# Altium schematic sheet Drivers.SchDoc
size A4
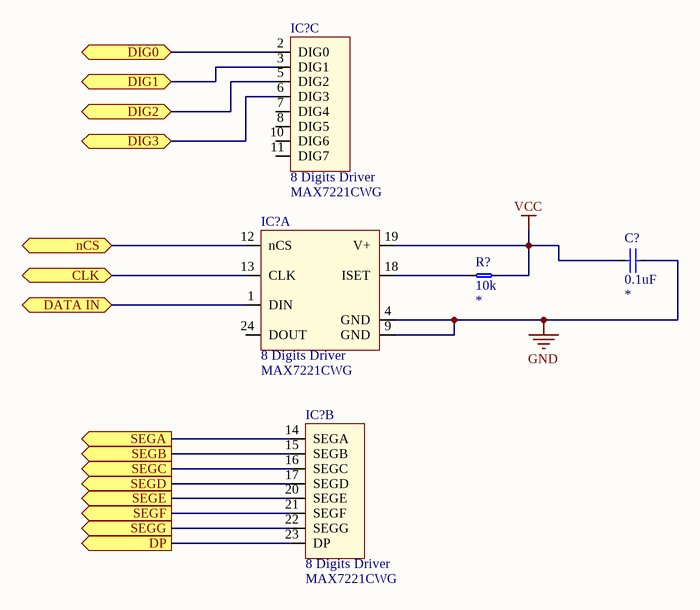
[diagram p0: Drivers.SchDoc]

## Parts
(Parts that share a designator on the sheet are numbered #1, #2 ... from top to bottom, then left to right.)
C?  value 0.1uF  [0402_CAP_LD]  (hidden comment: CerCap)
IC?#1  8 Digits Driver  [MAX7221CWG]  (part C of 3)
IC?#2  8 Digits Driver  [MAX7221CWG]  (part A of 3)
IC?#3  8 Digits Driver  [MAX7221CWG]  (part B of 3)
R?  value 10k  [0603_RES_LD]  (hidden comment: Resistor)

## Ports
CLK, DATA IN, DIG0, DIG1, DIG2, DIG3, DP (out), nCS, SEGA (out), SEGB (out), SEGC (out), SEGD (out), SEGE (out), SEGF (out), SEGG (out)

## Nets
GND: C?.2 IC?#2.4(GND) IC?#2.9(GND)
VCC: C?.1 IC?#2.19(V+) R?.2
CLK: IC?#2.13(CLK) ; port CLK
DATA IN: IC?#2.1(DIN) ; port DATA IN
DIG0: IC?#1.2(DIG0) ; port DIG0
DIG1: IC?#1.3(DIG1) ; port DIG1
DIG2: IC?#1.5(DIG2) ; port DIG2
DIG3: IC?#1.6(DIG3) ; port DIG3
DP: IC?#3.23(DP) ; port DP
nCS: IC?#2.12(nCS) ; port nCS
SEGA: IC?#3.14(SEGA) ; port SEGA
SEGB: IC?#3.15(SEGB) ; port SEGB
SEGC: IC?#3.16(SEGC) ; port SEGC
SEGD: IC?#3.17(SEGD) ; port SEGD
SEGE: IC?#3.20(SEGE) ; port SEGE
SEGF: IC?#3.21(SEGF) ; port SEGF
SEGG: IC?#3.22(SEGG) ; port SEGG
NetIC?#2_18: IC?#2.18(ISET) R?.1

Not connected (* = marked no-connect by the designer): IC?#1 7(DIG4) 8(DIG5) 10(DIG6) 11(DIG7); IC?#2 24(DOUT)

## Library data of the parts
C? = CerCap: Ceramic Capacitor; Type: *; Voltage/Power: *; Package: *
IC?#1-IC?#3 = MAX7221: MAX7221 8 Digit 7 Segments Display; Reference: MAX7221CWG
R? = Resistor: Precision: *; Package: *